# Altium schematic sheet PWR.SchDoc
size A4
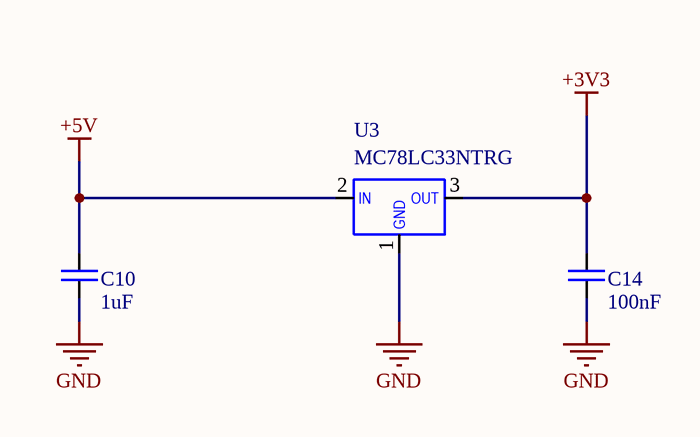
[diagram p0: PWR.SchDoc]

## Parts
C10  1uF  [CAP_0603]
C14  100nF  [CAP_0603]
U3  MC78LC33NTRG  [SOT753]

## Nets
+3V3: C14.1 U3.3(OUT)
+5V: C10.1 U3.2(IN)
GND: C10.2 C14.2 U3.1(GND)

## Library data of the parts
C10 = C_NONE_POLAR: None polar capacitor; Value: 1uF
C14 = C_NONE_POLAR: None polar capacitor; Value: 100n
U3 = MC78LC33NTRG: Low dropout Linear Voltage Regulator